# Altium schematic sheet Receptor.SchDoc: Receptores inalambricos
size A4; Revision: Londa
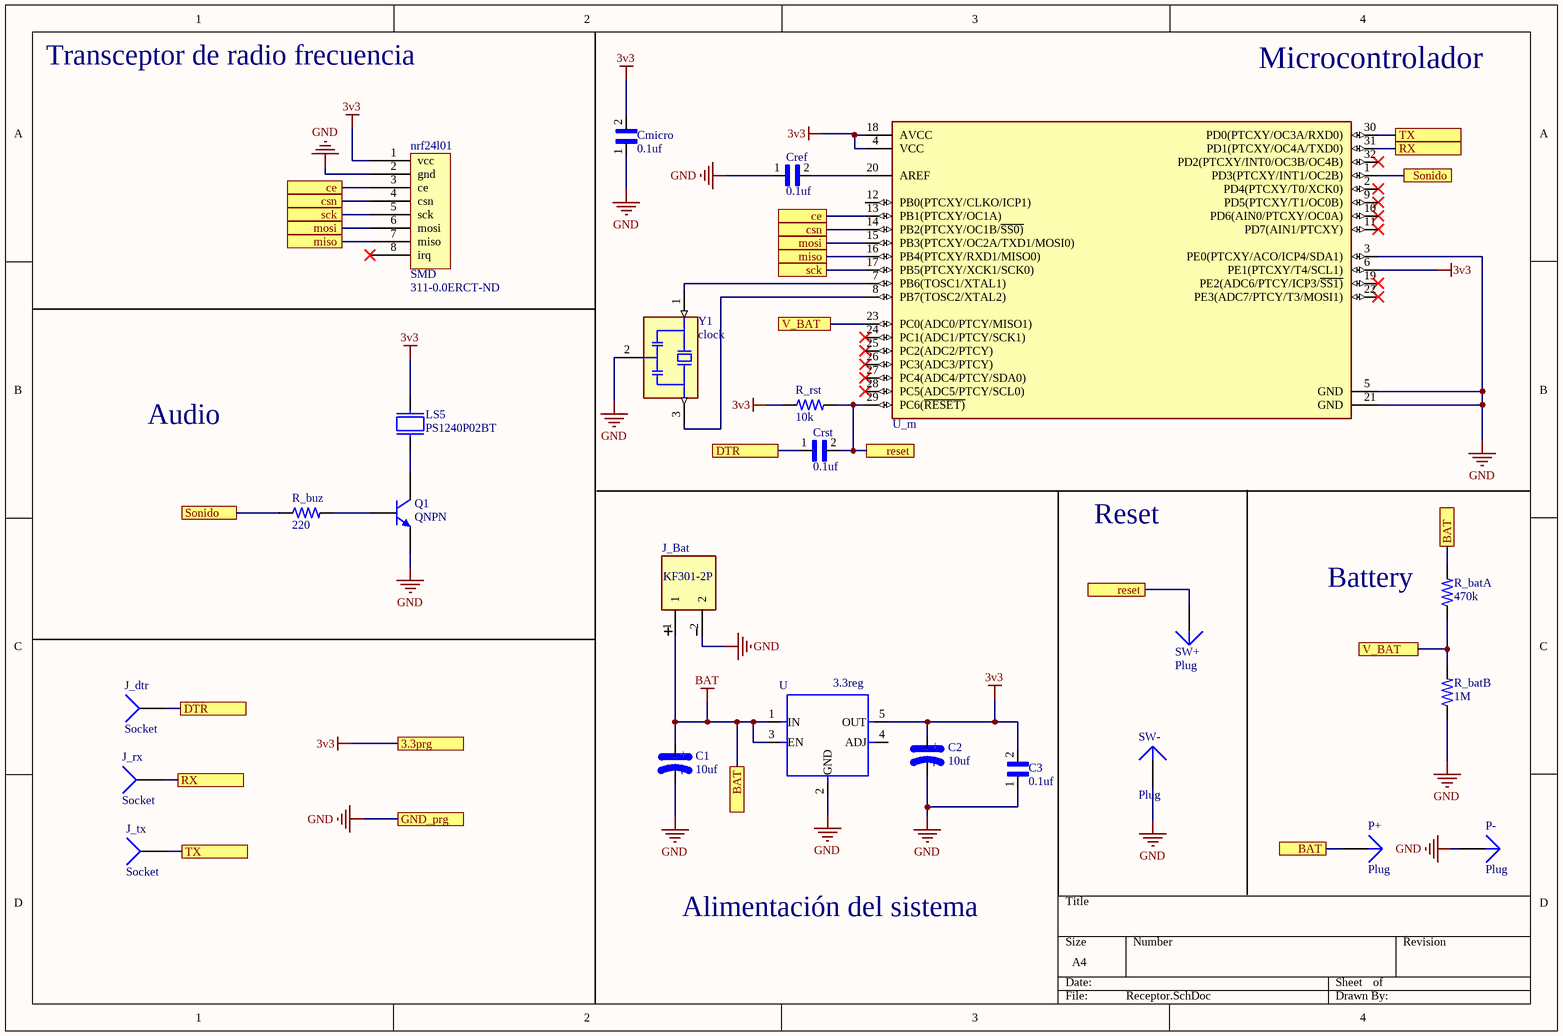
[diagram p0: Receptor.SchDoc]

## Parts
C1  10uf  [CT1206]
C2  10uf  [CT1206]
C3  0.1uf  [CAPC2012X94N]
Cmicro  0.1uf  [CAPC2012X94N]
Cref  0.1uf  [CAPC2012X94N]
Crst  0.1uf  [CAPC2012X94N]
J_Bat  KF301-2P  [HANDSON_KF301-2P]
J_dtr  Socket  [PIN1]
J_rx  Socket  [PIN1]
J_tx  Socket  [PIN1]
LS5  PS1240P02BT  [XDCR_PS1240P02BT]
nrf24l01  SMD  Supplier Part Number 1: 311-0.0ERCT-ND  [NRF24L01]
P+  Plug  [PIN1]
P-  Plug  [PIN1]
Q1  QNPN  [SOT-23B_N]
R_batA  470k  [RESC2012X65N]
R_batB  1M  [RESC2012X65N]
R_buz  220  [RESC2012X65N]
R_rst  10k  [RESC2012X65N]
SW+  Plug  [PIN1]
SW-  Plug  [PIN1]
U  3.3reg  [SOT-23-5]
U_m  ATMEGA328PB-AUR  [Microchip_C04-074_IPC_C]  (value not drawn)
Y1  clock  [OSC_CSTCE8M00G52-R0]

## Ports
3.3prg, BAT, ce, csn, DTR, GND_prg, miso, mosi, reset, RX, sck, Sonido, TX, V_BAT

## Nets
3v3: C2.POS C3.2 Cmicro.2 LS5.1 nrf24l01.1(vcc) R_rst.1 U.5(OUT) U_m.4(VCC) U_m.6(PE1(PTCXY/T4/SCL1)) U_m.18(AVCC) ; port 3.3prg
BAT: C1.POS J_Bat.1 P+.1 R_batA.2 U.1(IN) U.3(EN) ; port BAT
GND: C1.NEG C2.NEG C3.1 Cmicro.1 Cref.1 J_Bat.2 nrf24l01.2(gnd) P-.1 Q1.3(E) R_batB.1 SW-.1 U.2(GND) U_m.3(PE0(PTCXY/ACO/ICP4/SDA1)) U_m.5(GND) U_m.21(GND) Y1.2(GND) ; port GND_prg
ce: nrf24l01.3(ce) U_m.13(PB1(PTCXY/OC1A)) ; port ce
csn: nrf24l01.4(csn) U_m.14(PB2(PTCXY/OC1B/~{SS0)}) ; port csn
DTR: Crst.1 J_dtr.1 ; port DTR
miso: nrf24l01.7(miso) U_m.16(PB4(PTCXY/RXD1/MISO0)) ; port miso
mosi: nrf24l01.6(mosi) U_m.15(PB3(PTCXY/OC2A/TXD1/MOSI0)) ; port mosi
reset: Crst.2 R_rst.2 SW+.1 U_m.29(PC6(~{RESET)}) ; port reset
RX: J_rx.1 U_m.31(PD1(PTCXY/OC4A/TXD0)) ; port RX
sck: nrf24l01.5(sck) U_m.17(PB5(PTCXY/XCK1/SCK0)) ; port sck
Sonido: R_buz.1 U_m.1(PD3(PTCXY/INT1/OC2B)) ; port Sonido
TX: J_tx.1 U_m.30(PD0(PTCXY/OC3A/RXD0)) ; port TX
V_BAT: R_batA.1 R_batB.2 U_m.23(PC0(ADC0/PTCY/MISO1)) ; port V_BAT
NetCref_2: Cref.2 U_m.20(AREF)
NetLS5_2: LS5.2 Q1.1(C)
NetQ1_2: Q1.2(B) R_buz.2
NetU_m_7: U_m.7(PB6(TOSC1/XTAL1)) Y1.1(IN)
NetU_m_8: U_m.8(PB7(TOSC2/XTAL2)) Y1.3(OUT)

Not connected (* = marked no-connect by the designer): nrf24l01 8(irq)*; U 4(ADJ); U_m 2(PD4(PTCXY/T0/XCK0))* 9(PD5(PTCXY/T1/OC0B))* 10(PD6(AIN0/PTCXY/OC0A))* 11(PD7(AIN1/PTCXY))* 12(PB0(PTCXY/CLKO/ICP1)) 19(PE2(ADC6/PTCY/ICP3/~{SS1)})* 22(PE3(ADC7/PTCY/T3/MOSI1))* 24(PC1(ADC1/PTCY/SCK1))* 25(PC2(ADC2/PTCY))* 26(PC3(ADC3/PTCY))* 27(PC4(ADC4/PTCY/SDA0))* 28(PC5(ADC5/PTCY/SCL0))* 32(PD2(PTCXY/INT0/OC3B/OC4B))*

## Notes on the sheet
- Transceptor de radio frecuencia
- Microcontrolador
- Audio
- Reset
- (near R_batA) Battery
- Alimentación del sistema
- (in symbol TANTALUM-SMD-10UF-20V-20%(1206)) +; -

## Library data of the parts
C1 C2 = TANTALUM-SMD-10UF-20V-20%(1206): 10ÂµF Molded Tantalum Capacitors 20V 1206 _3216 Metric_ 5Ohm; MF: KEMET; MP: T491A106M020AT; Value: *; Package: 1206 Kemet; Price: None; Availability: Unavailable; SnapEDA_Link: https://www.snapeda.com/parts/T491A106M020AT/KEMET/view-part/104616/?ref=snap
C3 Cmicro Cref Crst = 0805YC103J4T2A: 10000pF Â±5% 16V Ceramic Capacitor X7R 0805 _2012 Metric_; MF: AVX; Package: 2012 AVX; Availability: Unavailable; Value: *; MP: 0805YC103J4T2A; SnapEDA_Link: https://www.snapeda.com/parts/0805YC103J4T2A/AVX/view-part/606803/?ref=snap; Price: None
J_Bat = KF301-2P: 2 Pin Terminal Block 5mm Pitch; MF: Handson Technology; Availability: Unavailable; MP: KF301-2P; Price: None; Value: *; SnapEDA_Link: https://www.snapeda.com/parts/KF301-2P/Handson%20Technology/view-part/4276957/?ref=snap; Package: Package
LS5 = PS1240P02BT: Buzzers Transducer, Externally Driven Piezo 3V 4kHz 60dB @ 3V, 10cm Through Hole PC Pins; MF: TDK; MP: PS1240P02BT; Availability: Unavailable; Package: 2020 TDK; Value: *; Price: None; SnapEDA_Link: https://www.snapeda.com/parts/PS1240P02BT/TDK/view-part/53420/?ref=snap
nrf24l01 = nrf24l01_smd: Supplier 1: Digi-Key
Q1 = QNPN: NPN Bipolar Transistor; Published: 8-Jun-2000; LatestRevisionDate: 29-May-2009; LatestRevisionNote: IPC-7351 Footprint Added.; PackageVersion: Aug-1999; PackageReference: SOT-23B; Publisher: Altium Limited; PackageDescription: 3-Pin SOT-23 Package 0.95 mm Pitch, 2.4 mm Lead Span
R_batA R_batB R_buz R_rst = 2-2176053-0: RES 0.33 OHM 1% 1/4W 0805; Resistance: .33; MF: TE Connectivity; Power_Rating: .25 W; Price: None; EU_RoHS_Compliance: Compliant with Exemptions; Tolerance: 1%; MP: 2-2176053-0; Value: *; Availability: Unavailable; SnapEDA_Link: https://www.snapeda.com/parts/2-2176053-0/TE%20Connectivity/view-part/2214508/?ref=snap; Package: 0805
U = PMIC-MIC5205-3.3YMSTR(SOT23-5): Linear Voltage Regulator IC 1 Output 150mA SOT-23-5; MP: MIC5205-3.3YM5-TR; MF: Microchip; SnapEDA_Link: https://www.snapeda.com/parts/MIC5205-3.3YM5-TR/Microchip/view-part/424295/?ref=snap; Value: *; Package: SOT-23-5 Microchip; Digi-Key_Part_Number: 576-1259-1-ND; Digi-Key_Purchase_URL: https://www.digikey.in/product-detail/en/microchip-technology/MIC5205-3.3YM5-TR/576-1259-1-ND/771886?utm_source=snapeda&utm_medium=aggregator&utm_campaign=symbol
Y1 = CSTCE8M00G52-R0: 8MHz Ceramic Resonator Built in Capacitor 10pF Â±0.2% -20Â°C ~ 80Â°C Surface Mount; MF: Murata; Price: None; Check_prices: https://www.snapeda.com/parts/CSTCE8M00G52-R0/Murata%20Electronics%20North%20America/view-part/234504/?ref=eda; SnapEDA_Link: https://www.snapeda.com/parts/CSTCE8M00G52-R0/Murata%20Electronics%20North%20America/view-part/234504/?ref=snap; Package: Surface Mount Murata Electronics North America; Availability: Bad; MP: CSTCE8M00G52-R0; Value: *
J_dtr J_rx J_tx = Socket: LatestRevisionDate: 17-Jul-2002; LatestRevisionNote: Re-released for DXP Platform.; Publisher: Altium Limited
P+ P- SW+ SW- = Plug: LatestRevisionDate: 17-Jul-2002; LatestRevisionNote: Re-released for DXP Platform.; Publisher: Altium Limited